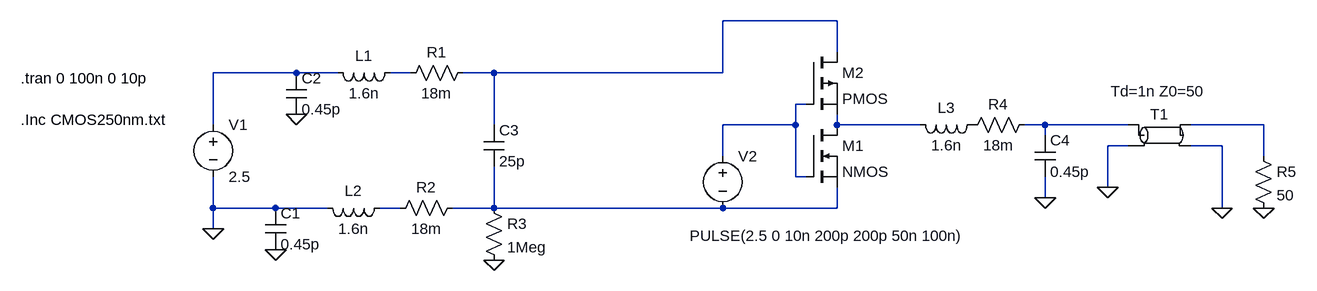
[diagram p0: schematic Draft2.asc]
Draft2.asc, the LTspice schematic file:
Version 4.1
SHEET 1 1816 680
WIRE 1104 -80 928 -80
WIRE 1104 -32 1104 -80
WIRE 272 0 144 0
WIRE 336 0 272 0
WIRE 448 0 416 0
WIRE 576 0 528 0
WIRE 928 0 928 -80
WIRE 928 0 576 0
WIRE 1056 48 1040 48
WIRE 144 80 144 0
WIRE 576 80 576 0
WIRE 1040 80 1040 48
WIRE 1040 80 928 80
WIRE 1104 80 1104 64
WIRE 1232 80 1104 80
WIRE 1424 80 1392 80
WIRE 1552 80 1424 80
WIRE 1760 80 1648 80
WIRE 1424 96 1424 80
WIRE 1552 112 1520 112
WIRE 1696 112 1648 112
WIRE 928 128 928 80
WIRE 1760 128 1760 80
WIRE 1040 160 1040 80
WIRE 1056 160 1040 160
WIRE 1520 176 1520 112
WIRE 1424 192 1424 160
WIRE 144 208 144 160
WIRE 240 208 144 208
WIRE 320 208 240 208
WIRE 432 208 400 208
WIRE 576 208 576 144
WIRE 576 208 512 208
WIRE 928 208 576 208
WIRE 1104 208 1104 176
WIRE 1104 208 928 208
WIRE 1696 208 1696 112
WIRE 144 240 144 208
FLAG 144 240 0
FLAG 240 272 0
FLAG 272 64 0
FLAG 576 288 0
FLAG 1424 192 0
FLAG 1520 176 0
FLAG 1696 208 0
FLAG 1760 208 0
SYMBOL voltage 144 64 R0
WINDOW 123 0 0 Left 0
WINDOW 39 0 0 Left 0
SYMATTR InstName V1
SYMATTR Value 2.5
SYMBOL cap 224 208 R0
SYMATTR InstName C1
SYMATTR Value 0.45p
SYMBOL cap 256 0 R0
SYMATTR InstName C2
SYMATTR Value 0.45p
SYMBOL ind 432 -16 R90
WINDOW 0 5 56 VBottom 2
WINDOW 3 32 56 VTop 2
SYMATTR InstName L1
SYMATTR Value 1.6n
SYMATTR SpiceLine Rser=1m
SYMBOL res 544 -16 R90
WINDOW 0 0 56 VBottom 2
WINDOW 3 32 56 VTop 2
SYMATTR InstName R1
SYMATTR Value 18m
SYMBOL ind 416 192 R90
WINDOW 0 5 56 VBottom 2
WINDOW 3 32 56 VTop 2
SYMATTR InstName L2
SYMATTR Value 1.6n
SYMATTR SpiceLine Rser=1m
SYMBOL res 528 192 R90
WINDOW 0 0 56 VBottom 2
WINDOW 3 32 56 VTop 2
SYMATTR InstName R2
SYMATTR Value 18m
SYMBOL cap 560 80 R0
SYMATTR InstName C3
SYMATTR Value 25p
SYMBOL res 560 192 R0
SYMATTR InstName R3
SYMATTR Value 1Meg
SYMBOL voltage 928 112 R0
WINDOW 3 -51 139 Left 2
WINDOW 123 0 0 Left 0
WINDOW 39 0 0 Left 0
SYMATTR InstName V2
SYMATTR Value PULSE(2.5 0 10n 200p 200p 50n 100n)
SYMBOL nmos 1056 80 R0
SYMATTR InstName M1
SYMBOL pmos 1056 -32 R0
SYMATTR InstName M2
SYMBOL ind 1328 64 R90
WINDOW 0 5 56 VBottom 2
WINDOW 3 32 56 VTop 2
SYMATTR InstName L3
SYMATTR Value 1.6n
SYMATTR SpiceLine Rser=1m
SYMBOL res 1408 64 R90
WINDOW 0 0 56 VBottom 2
WINDOW 3 32 56 VTop 2
SYMATTR InstName R4
SYMATTR Value 18m
SYMBOL cap 1408 96 R0
SYMATTR InstName C4
SYMATTR Value 0.45p
SYMBOL tline 1600 96 R0
WINDOW 3 -2 -83 Top 2
SYMATTR InstName T1
SYMATTR Value Td=1n Z0=50
SYMBOL res 1744 112 R0
SYMATTR InstName R5
SYMATTR Value 50
TEXT -152 72 Left 2 !.Inc CMOS250nm.txt
TEXT -152 8 Left 2 !.tran 0 100n 0 10p

The netlist it stands for:
* Draft2.asc
V1 N002 0 2.5
C1 0 0 0.45p
C2 N002 0 0.45p
L1 N003 N002 1.6n Rser=1m
R1 N001 N003 18m
L2 N008 0 1.6n Rser=1m
R2 N009 N008 18m
C3 N001 N009 25p
R3 N009 0 1Meg
V2 N004 N009 PULSE(2.5 0 10n 200p 200p 50n 100n)
M1 N005 N004 N009 N009 NMOS
M2 N001 N004 N005 N005 PMOS
L3 P001 N005 1.6n Rser=1m
R4 N006 P001 18m
C4 N006 0 0.45p
T1 N006 0 N007 0 Td=1n Z0=50
R5 N007 0 50
.model NMOS NMOS
.model PMOS PMOS
.lib standard.mos
.Inc CMOS250nm.txt
.tran 0 100n 0 10p
.backanno
.end